# Altium project uHAL_DS18B20.PrjPcb
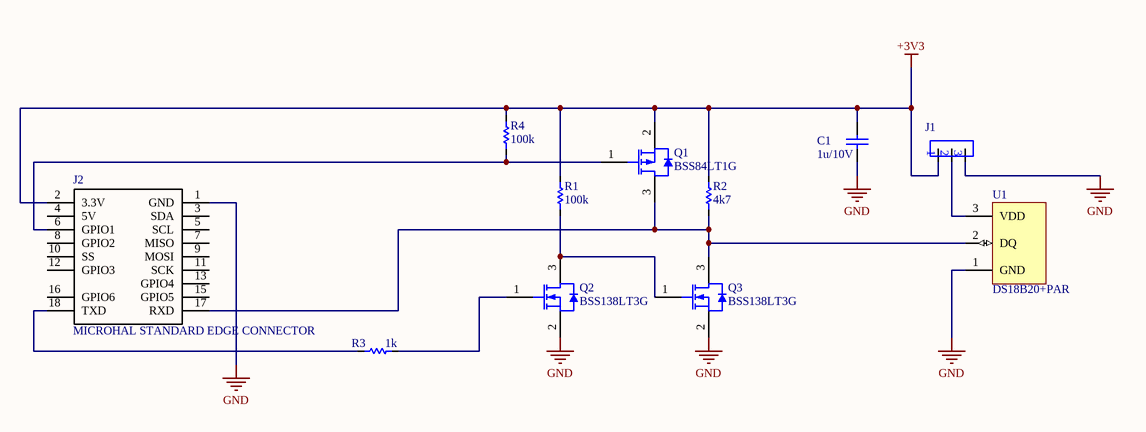
[diagram p0: DS18B20.SchDoc]
1 sheet, 11 parts. Net scope: global (net labels, ports and power ports of the same name join across sheets).

## Sheet DS18B20.SchDoc
size A4

### Parts
C1  1u/10V  [CAPC2013X140X50ML20T25]
J1  SYM-52d299a8d8748d15-1  [PCB-vkgeqjtjqx6hhmcxuagx-1]  (value not drawn)
J2  MICROHAL STANDARD EDGE CONNECTOR  [PCB-n61ghpg3sznbl2uw6fwj-1]
Q1  BSS84LT1G  [ONSC-SOT-23-3-318-08]
Q2  BSS138LT3G  [ONSC-SOT-23-3-318-08_V]
Q3  BSS138LT3G  [ONSC-SOT-23-3-318-08_V]
R1  100k  [PCB-cmzy4aezi5zhn2bew7lt-1]
R2  4k7  [PCB-cmzy4aezi5zhn2bew7lt-1]
R3  1k  [PCB-cmzy4aezi5zhn2bew7lt-1]
R4  100k  [PCB-cmzy4aezi5zhn2bew7lt-1]
U1  DS18B20+PAR  [Q3+1]

### Nets
+3V3: C1.2 J1.1 J2.2(3.3V) Q1.2(S) R1.2 R2.2 R4.2
GND: C1.1 J1.3 J2.1(GND) Q2.2(S) Q3.2(S) U1.1(GND)
NetJ1_2: J1.2 U1.3(VDD)
NetJ2_6: J2.6(GPIO1) Q1.1(G) R4.1
NetJ2_17: J2.17(RXD) Q1.3(D) Q3.3(D) R2.1 U1.2(DQ)
NetJ2_18: J2.18(TXD) R3.2
NetQ2_1: Q2.1(G) R3.1
NetQ2_3: Q2.3(D) Q3.1(G) R1.1

Not connected (* = marked no-connect by the designer): J2 3(SDA) 4(5V) 5(SCL) 7(MISO) 8(GPIO2) 9(MOSI) 10(SS) 11(SCK) 12(GPIO3) 13(GPIO4) 15(GPIO5) 16(GPIO6)

### Library data of the parts
C1 = CMP-126530-2: CAP CER 1UF 10V 10% X7R 0805; Capacitance: 1e-06 F; Case/Package (SI): 2012; Dielectric Material: Ceramic Multilayer; Insulation Resistance: 1e+11 Ω; Lead-Free Status: Lead Free; Voltage Rating (DC): 10.0 V; Capacitance Tolerance: ±10%; Case/Package: 0805; Dielectric Characteristic: X7R; Mounting Style: Surface Mount; Number of Pins: 2; Octopart Url: https://octopart.com/0805zc105kat2a-avx+interconnect+%2F+elco-12174; OctopartID: e3c02acae9283c07; REACH SVHC Compliance: No SVHC; RoHS: Compliant; Size-Height: 0.0014 m; Size-Length: 0.00201 m; Size-Thickness: 0.0009398 m; Size-Width: 0.00125 m
J1 = CMP-740dbf71fd8babca-12: AMPMODU 3 Position 2.54 mm Single Row Through-Hole Straight Breakaway Header; Gender: Male; Contact Material: Phosphor Bronze; Mounting Style: PCB
J2 = CMP-6a3uyflm72uf0am1b36s-2: microhal standard edge connector with 17 pins
Q1 = CMP-10937362-2: MOSFET; Breakdown Voltage (Drain to Source): 50.0 V; Continuous Drain Current (Ids): 0.13 A; Current Rating: -0.13 A; Drain to Source Resistance (on) (Rds): 10.0 Ω; Input Capacitance: 3e-11 F; Lead-Free Status: Lead Free; Polarity: P-Channel; Power Dissipation: 0.225 W; Rise Time: 1e-09 s; Voltage Rating (DC): -50.0 V; Case/Package: SOT-23; Drain to Source Voltage (Vds): 50.0 V; Halogen Free Status: Halogen Free; Lifecycle Status: Active; Mounting Style: Surface Mount; Number of Pins: 3; Octopart Url: https://octopart.com/bss84lt1g-on+semiconductor-335928; OctopartID: f8ac31a3fdf2276b; Packaging: Cut Tape (CT); REACH SVHC Compliance: No SVHC; RoHS: Compliant
Q2 Q3 = CMP-14439175-2: Power MOSFET, 200 mA, 50 V, N-Channel, 3-Pin SOT-23, Pb-Free, Tape and Reel; Breakdown Voltage (Drain to Source): 50.0 V; Continuous Drain Current (Ids): 0.2 A; Drain to Source Resistance (on) (Rds): 3.5 Ω; Input Capacitance: 5e-11 F; Lead-Free Status: Lead Free; Power Dissipation: 0.225 W; Case/Package: SOT-23; Current Rating: 0.2 A; Drain to Source Voltage (Vds): 50.0 V; Halogen Free Status: Halogen Free; Lifecycle Status: Active; Mounting Style: Surface Mount; Number of Pins: 3; Octopart Url: https://octopart.com/bss138lt3g-on+semiconductor-847373; OctopartID: b7057e037c6e68c2; Packaging: Tape; Polarity: N-Channel; REACH SVHC Compliance: No SVHC; RoHS: Compliant; Voltage Rating (DC): 50.0 V
R1-R4 = CMP-40e08b60e91c9f27-1: Surface Mount Chip Resistor, Thick Film, AEC-Q200 CRCW Series, 4.7 kohm, 250 mW, 1%, 75 V; Manufacturer Part Number: CRCW06034K70FKEAHP; Case/Package (SI): 1608; Voltage Rating (DC): 75.0 V; Lead-Free Status: Lead Free; Power Rating: 250 mW; Resistance: 4.70 kΩ; Case/Package: 0603; Number of Pins: 2; REACH SVHC Compliance: No SVHC; OctopartID: 40e08b60e91c9f27; Packaging: Cut Tape (CT); Mounting Style: Surface Mount; Octopart URL: http://octopart.com/crcw06034k70fkeahp-vishay-42634394; Resistance Tolerance: ±1%
U1 = CMP-978384-4: Programmable Resolution Digital Thermometer, 1-Wire Interface, ±0.5°C Accuracy, 3-Pin TO92, -40°C to +85°C, Pb-Free; Supply Current: 0.001 A; Number of Bits: 12; Lead-Free Status: Lead Free; Number of Pins: 3; Octopart Url: https://octopart.com/ds18b20%2Bpar-maxim+integrated-8303542; OctopartID: aeda67ae380a711d; Packaging: Bulk; RoHS: Compliant; Mounting Style: Through Hole; Lifecycle Status: Not Listed by Manufacturer